# EAGLE design JoyDivision (EAGLE 7.6.0)
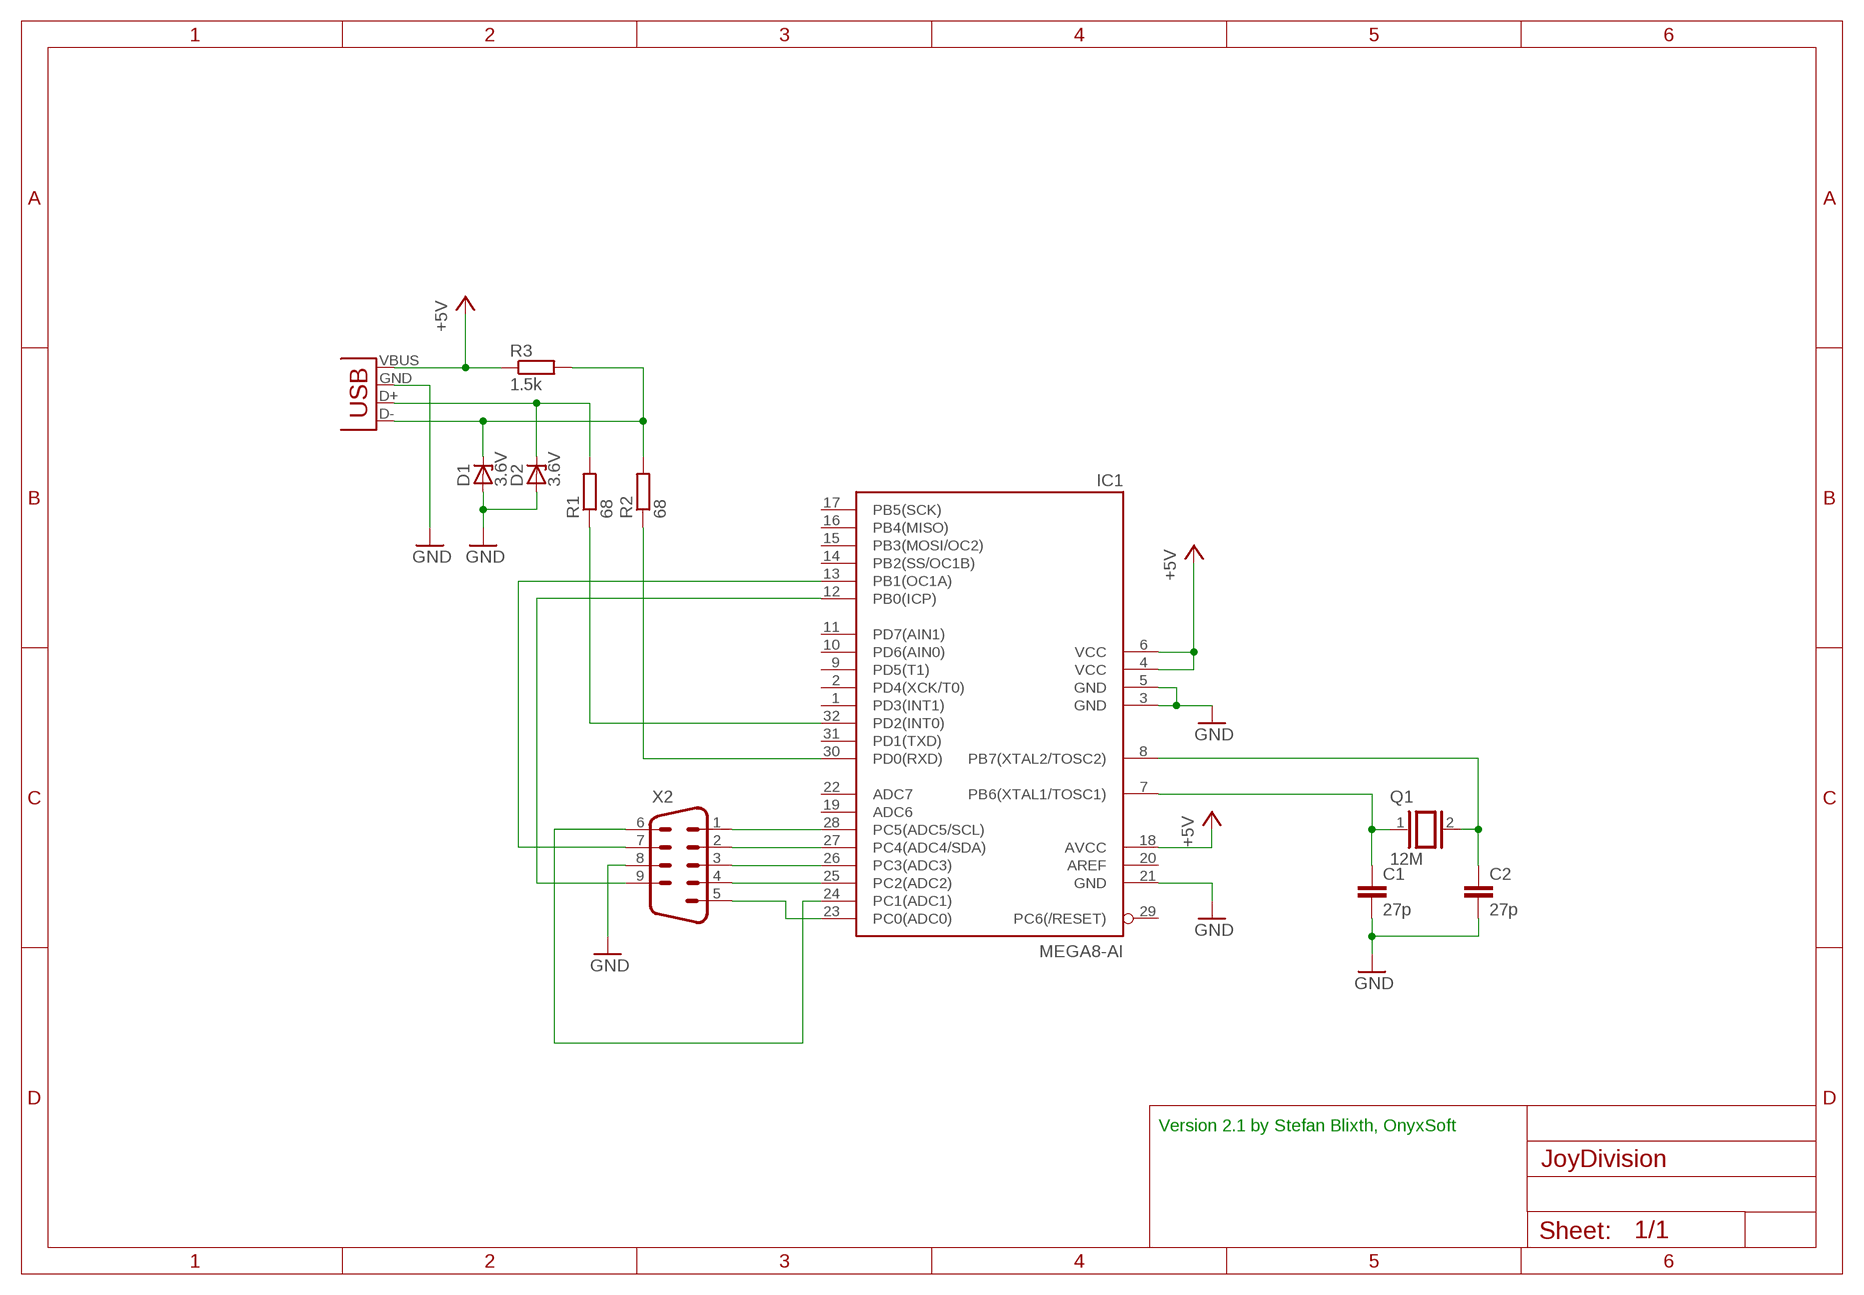
[diagram p0: schematic, sheet 1]

## Parts
C1  27p  C-EUC0805  [C0805]
C2  27p  C-EUC0805  [C0805]
D1  3.6V  ZENER-DIODESOD80C  [SOD80C]
D2  3.6V  ZENER-DIODESOD80C  [SOD80C]
IC1  MEGA8-AI  [TQFP32-08]
JP1  USB-A-H  [USB-A-H]
Q1  12M  XTAL/S  [QS]
R1  68  R-EU_M0805  [M0805]
R2  68  R-EU_M0805  [M0805]
R3  1.5k  R-EU_M0805  [M0805]
X2  M09D  [M09D]

## Nets
+5V: IC1.4(VCC) IC1.6(VCC) IC1.18(AVCC) JP1.VBUS(GND) R3.1
GND: C1.2 C2.2 D1.A D2.A IC1.3(GND) IC1.5(GND) IC1.21(GND) JP1.GND(VBUS) X2.8
N$1: D1.C JP1.D-(D+) R2.2 R3.2
N$2: D2.C JP1.D+(D-) R1.2
N$3: IC1.30(PD0(RXD)) R2.1
N$4: IC1.32(PD2(INT0)) R1.1
N$5: C1.1 IC1.7(PB6(XTAL1/TOSC1)) Q1.1
N$6: C2.1 IC1.8(PB7(XTAL2/TOSC2)) Q1.2
N$9: IC1.28(PC5(ADC5/SCL)) X2.1
N$10: IC1.27(PC4(ADC4/SDA)) X2.2
N$11: IC1.26(PC3(ADC3)) X2.3
N$12: IC1.25(PC2(ADC2)) X2.4
N$13: IC1.24(PC1(ADC1)) X2.6
N$14: IC1.23(PC0(ADC0)) X2.5
N$15: IC1.12(PB0(ICP)) X2.9
N$19: IC1.13(PB1(OC1A)) X2.7
Unconnected: IC1.1(PD3(INT1)) IC1.2(PD4(XCK/T0)) IC1.9(PD5(T1)) IC1.10(PD6(AIN0)) IC1.11(PD7(AIN1)) IC1.14(PB2(SS/OC1B)) IC1.15(PB3(MOSI/OC2)) IC1.16(PB4(MISO)) IC1.17(PB5(SCK)) IC1.19(ADC6) IC1.20(AREF) IC1.22(ADC7) IC1.29(PC6(/RESET)) IC1.31(PD1(TXD))

## Notes on the sheet
- Version 2.1 by Stefan Blixth, OnyxSoft

## Library data of the parts
C1 C2 = rcl:C-EU: CAPACITOR, European symbol
D1 D2 = diode:ZENER-DIODE: Z-Diode
IC1 = atmel:MEGA8: MICROCONTROLLER 8 Kbytes FLASH, 1 kbytes SRAM, 512 bytes EEPROM, USART, 6-channel 10 bit ADC, 2-channel 8 bit ADC Pin compatible with Atmega48, ATMega88, ATMega168 Source: avr.lbr; MPN: ATMEGA8-16AU; OC_FARNELL: 9171371; OC_NEWARK: 73M8863
JP1 = SparkFun-Connectors:USB: USB Connectors USB-B-PTH is fully proven SKU : PRT-00139/CONN-08278 USB-miniB is fully proven SKU : PRT-00587 USB-A-PCB is untested. USB-A-H is throughly reviewed, but untested. Spark Fun Electronics SKU : PRT-00437 USB-B-SMT is throughly reviewed, but untested. Needs silkscreen touching up. USB-A-S has not been used/tested USB-MB-H has not been used/tested USB-MICROB has been used. CONN-09505
Q1 = special:XTAL/S: CRYSTAL
R1-R3 = rcl:R-EU_: RESISTOR, European symbol
X2 = con-subd:M09: SUB-D; OC_FARNELL: unknown; OC_NEWARK: unknown

## Board
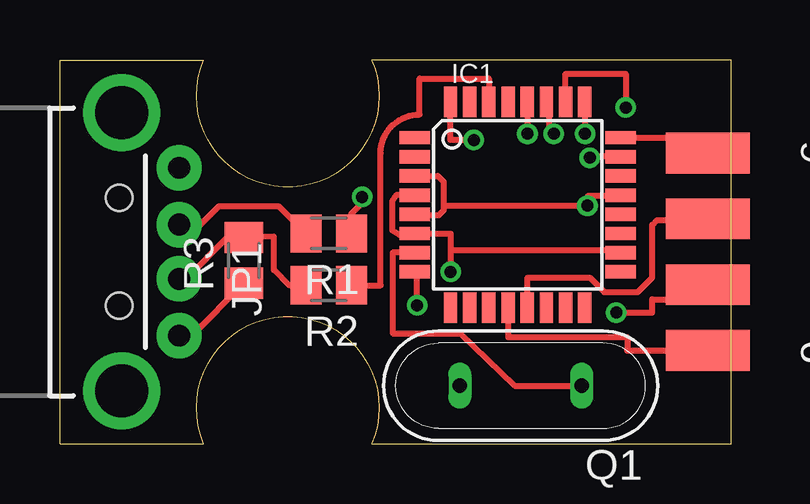
[diagram p1: board, top side]
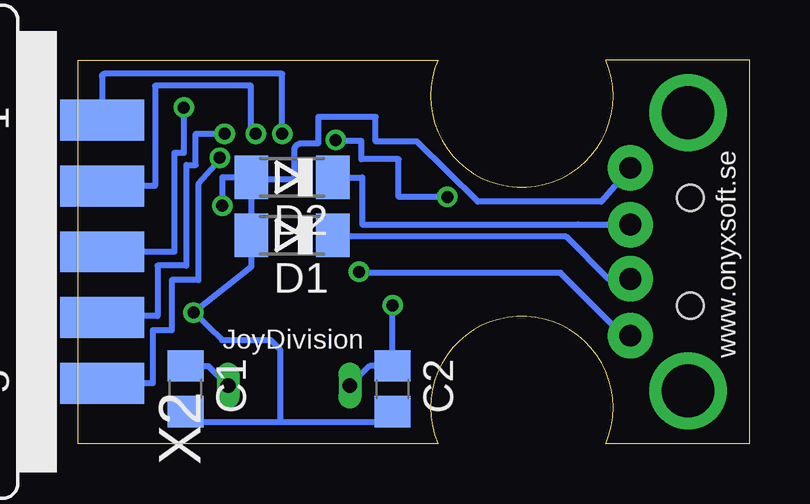
[diagram p2: board, bottom side, seen from below]

Size 28 x 16 mm. Coordinates in mm from the lower left corner, seen from the top.
Outline: 0,16 6,16 arc226 13,16 28,16 28,0 13,0 arc226 6,0 0,0 0,16
Copper layers (1*16): Top 0.0356mm / dielectric 1.5011mm / Bottom 0.0356mm
Design rules "LaenPCBOrder": minimum track width 6mil, minimum drill 13mil, track to track 6mil, track to pad 6mil, pad to pad 6mil, via to via 6mil, smd to smd 6mil, copper to edge 15mil, drill to drill 6mil, minimum pad ring 7mil, minimum via ring 7mil, stop-mask expansion 3mil, vias tented up to drill 0mil, thermal gap 10mil

### Footprints (pad centres in the part's own frame; a part is rotated, then mirrored left to right if it is on the bottom)
C0805 = smd 1.3 x 1.5: 1 -0.95,0; 2 0.95,0
SOD80C = smd 1.4 x 1.8: A 1.7,0; C -1.7,0
TQFP32-08 = smd 1.27 x 0.559: 1 -4.293,2.8; 2 -4.293,2; 3 -4.293,1.2; 4 -4.293,0.4; 5 -4.293,-0.4; 6 -4.293,-1.2; 7 -4.293,-2; 8 -4.293,-2.8; 17 4.293,-2.8; 18 4.293,-2; 19 4.293,-1.2; 20 4.293,-0.4; 21 4.293,0.4; 22 4.293,1.2; 23 4.293,2; 24 4.293,2.8 | smd 0.559 x 1.27: 9 -2.8,-4.293; 10 -2,-4.293; 11 -1.2,-4.293; 12 -0.4,-4.293; 13 0.4,-4.293; 14 1.2,-4.293; 15 2,-4.293; 16 2.8,-4.293; 25 2.8,4.293; 26 2,4.293; 27 1.2,4.293; 28 0.4,4.293; 29 -0.4,4.293; 30 -1.2,4.293; 31 -2,4.293; 32 -2.8,4.293
USB-A-H = drill 0.914 pad 1.88: D+ 2.4,1.127; D- 2.4,-1.127; GND 2.4,3.5; VBUS 2.4,-3.5 | drill 2.2: GND2 0,-5.8; GND3 0,5.8 | hole 1.1: -0.1,2.25; -0.1,-2.25
QS = drill 0.61 long: 1 -2.54,0; 2 2.54,0
M0805 = smd 1.3 x 1.6: 1 -0.95,0; 2 0.95,0
M09D = smd 1.7 x 3.5: 1 5.486,-6.045; 2 2.743,-6.045; 3 0,-6.045; 4 -2.743,-6.045; 5 -5.486,-6.045 | smd 1.7 x 3.5 bottom: 6 4.115,-6.045; 7 1.372,-6.045; 8 -1.372,-6.045; 9 -4.115,-6.045

### Placement (x,y rotation side)
C1  23.53,2.29 270 bottom
C2  14.89,2.29 270 bottom
D1  19.08,8.69 180 bottom
D2  19.08,11.1 180 bottom
IC1  19.08,9.96 0 top
JP1  2.57,8 0 top
Q1  19.21,2.41 180 top
R1  11.21,8.76 180 top
R2  11.21,6.6 180 top
R3  7.67,7.64 90 top
X2  33.05,8 90 bottom

### Tracks (layer width: path | path; a pad name or v marks a point on that pad's centre or on a via)
+5V  (via drill 0.5)
  Top 0.254: JP1.VBUS 5.48,4.5 R3.1 | 16.29,8.05 16.29,8.76 IC1.6 14.83,8.72 14.15,8.72 13.85,8.9 13.85,10.11 14.02,10.36 IC1.4 | 16.29,8.05 v16.29,7.16 | IC1.18 23.28,8.05 16.29,8.05
  Bottom 0.254: JP1.VBUS 5.27,4.5 7.89,7.12 16.24,7.12 v16.29,7.16
GND  (via drill 0.5)
  Top 0.254: IC1.21 23.33,10.32 21.99,10.32 v21.99,9.92 15.99,9.92 | 15.99,9.92 15.99,9.72 15.79,9.52 14.83,9.52 IC1.5 | IC1.3 15.75,11.16 15.99,10.92 15.99,9.92 | 27,6.23 X2.8 27,6.02 24.69,6.02 24.69,5.46 v23.19,5.46
  Bottom 0.254: C2.2 15.34,0.89 19.59,0.89 | 19.59,0.89 23.02,0.89 23.46,1.34 C1.2 | D2.A D1.A 20.78,7.37 v23.19,5.46 22,4.32 19.97,4.32 19.59,3.94 19.59,0.89 | JP1.GND 6.18,10.09 11.33,10.09 13.87,12.6 15.59,12.6 15.59,13.62 17.99,13.62 17.99,12.52 18.69,12.52 arc-90 18.99,12.22 18.99,11.02 20.7,11.02 D2.A | D2.A 21.99,11.1 v21.99,9.92
N$1
  Top 0.254: R2.2 9.56,6.6 8.92,7.24 8.92,8.63 R3.2 7.63,8.63 7.01,8.63 5.25,6.87 JP1.D-
  Bottom 0.254: JP1.D- 5.89,6.87 7.65,8.63 17,8.63 D1.C
N$2
  Top 0.254: JP1.D+ 5.86,9.13 6.63,9.91 9.11,9.91 R1.2
  Bottom 0.254: D2.C 16.16,11.1 16.16,9.14 7.14,9.14 JP1.D+
N$3
  Top 0.254: R2.1 13.36,6.6 13.36,12.09 arc-90 14.99,13.72 14.99,15.22 17.88,15.22 IC1.30
N$4  (via drill 0.5)
  Top 0.254: R1.1 12.16,9.59 12.6,10.03 v12.6,10.29 | v17.26,12.66 16.28,12.66 IC1.32
  Bottom 0.254: v12.6,10.29 14.64,10.29 14.64,11.86 16.19,11.86 16.19,12.62 17.19,12.62 v17.26,12.66
N$5
  Top 0.254: IC1.7 13.87,7.96 13.87,4.6 16.67,4.6 18.95,2.41 Q1.1
  Bottom 0.254: C1.1 22.57,3.23 Q1.1
N$6  (via drill 0.5)
  Top 0.254: v14.89,5.77 14.89,7.06 IC1.8
  Bottom 0.254: Q1.2 15.84,3.23 C2.1 v14.89,5.77
N$9  (via drill 0.5)
  Top 0.254: IC1.28 v19.49,12.92
  Bottom 0.254: 26.95,13.49 X2.1 27,15.3 arc90 26.89,15.42 19.49,15.42 v19.49,12.92
N$10  (via drill 0.5)
  Top 0.254: IC1.27 20.39,14.14 20.39,13.12 v20.59,12.92
  Bottom 0.254: v20.59,12.92 20.79,13.12 20.79,14.92 24.79,14.92 24.79,10.74 X2.2
N$11  (via drill 0.5)
  Top 0.254: IC1.26 21.08,15.42 23.59,15.42 v23.59,14.02
  Bottom 0.254: v23.59,14.02 23.59,12.12 23.99,12.12 23.99,8 X2.3
N$12  (via drill 0.5)
  Top 0.254: IC1.25 arc-90 IC1.25 v21.89,12.92
  Bottom 0.254: 26.94,5.32 X2.4 27,5.32 24.69,5.32 24.69,7.42 23.49,7.42 23.49,11.62 23.09,11.62 23.09,12.92 v21.89,12.92
N$13
  Top 0.254: IC1.24 25.62,12.76 26.32,12.06 26.95,12.06 X2.6
N$14  (via drill 0.5 pad 0.25)
  Top 0.254: IC1.23 22.13,11.96 v22.09,11.92
  Bottom 0.254: v22.09,11.92 22.09,11.82 22.99,10.82 22.99,6.82 24.09,6.82 24.09,4.72 24.89,4.72 24.89,2.51 X2.5
N$15
  Top 0.254: IC1.12 18.68,4.44 23.65,4.44 23.65,3.88 X2.9
N$19
  Top 0.254: IC1.13 19.49,6.92 22.09,6.92 22.69,6.32 24.09,6.32 24.69,6.92 24.69,9.12 24.89,9.32 26.95,9.32 X2.7

### Text on the board
bNames: www.onyxsoft.se | JoyDivision